# Altium project SoundBoi.PrjPcb
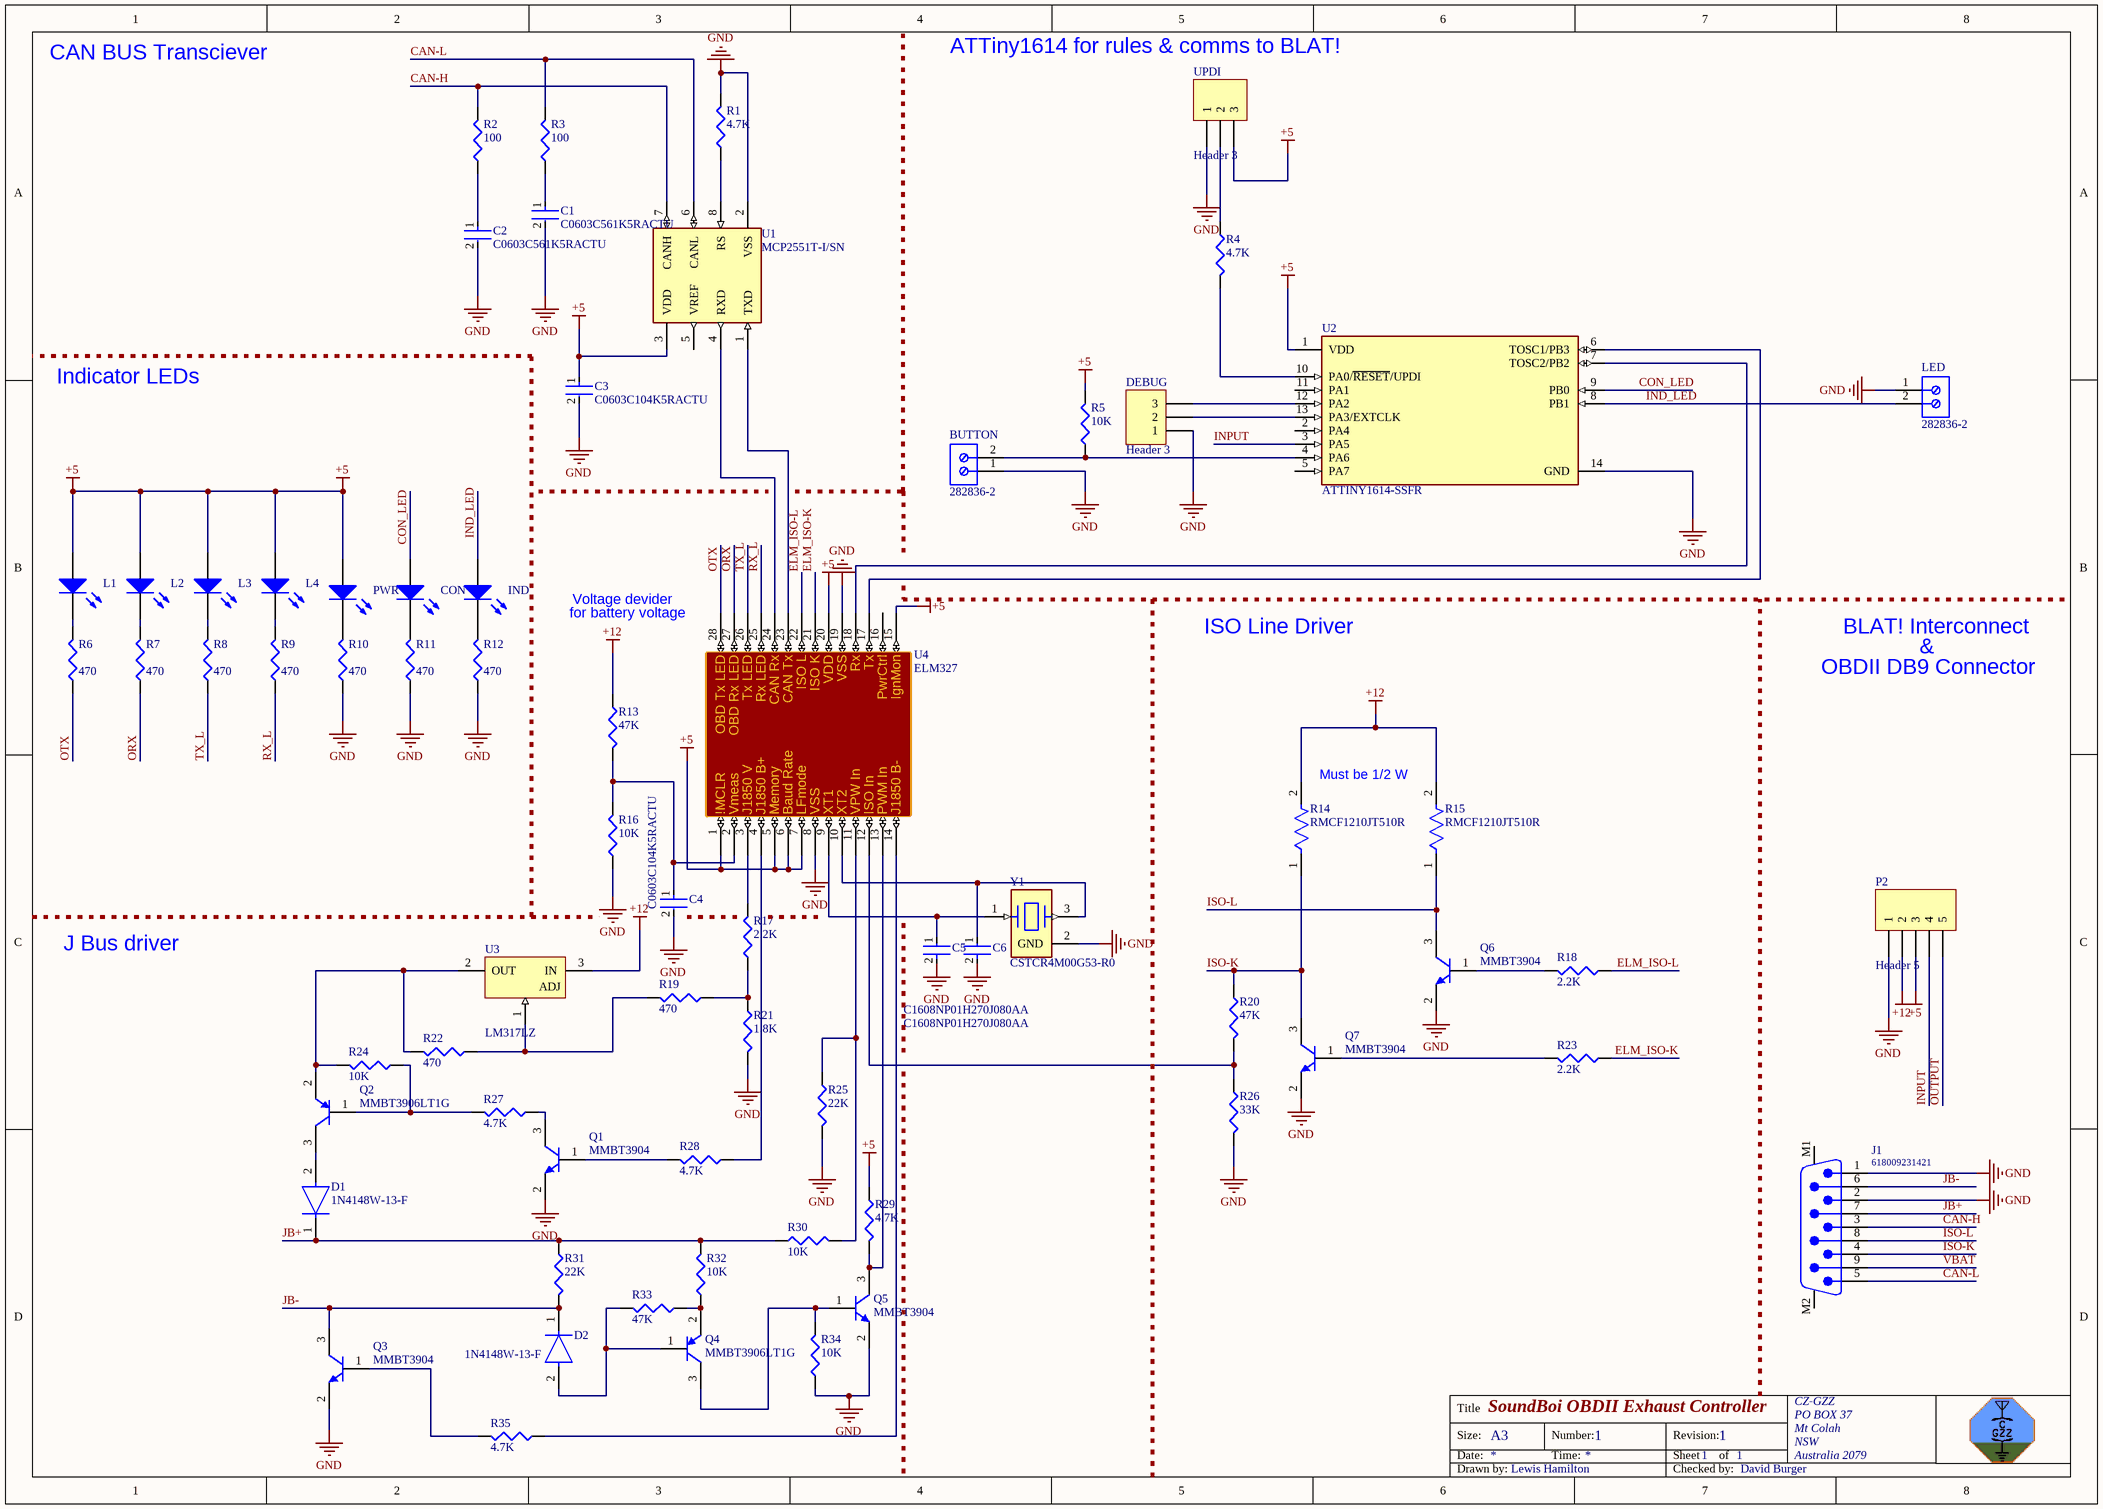
[diagram p0: Main.SchDoc]
1 sheet, 68 parts. Net scope: global (net labels, ports and power ports of the same name join across sheets).
Board file: PCB.PcbDoc

## Sheet Main.SchDoc: SoundBoi OBDII Exhaust Controller
size A3; CheckedBy: David Burger; Author: Lewis Hamilton; CompanyName: CZGZZ; DrawnBy: Lewis Hamilton; Engineer: Lewis Hamilton; Organization: CZ-GZZ; Address1: PO BOX 37; Address2: Mt Colah; Address3: NSW; Address4: Australia 2079; DocumentNumber: 1; Revision: 1; SheetNumber: 1; SheetTotal: 1

### Parts
BUTTON  282836-2  [TECO-282836-2_V]
C1  C0603C561K5RACTU  [FP-C0603C-CF-MFG]
C2  C0603C561K5RACTU  [FP-C0603C-CF-MFG]
C3  C0603C104K5RACTU  [FP-C0603C-CF-MFG]
C4  C0603C104K5RACTU  [FP-C0603C-CF-MFG]
C5  C1608NP01H270J080AA  [FP-C1608-080-0_1-IPC_A]
C6  C1608NP01H270J080AA  [FP-C1608-080-0_1-IPC_A]
CON  LED2  [3.2X1.6X1.1]  (value not drawn)
D1  1N4148W-13-F  [FP-SOD123-MFG]
D2  1N4148W-13-F  [FP-SOD123-MFG]
DEBUG  Header 3  [HDR1X3]
IND  LED2  [3.2X1.6X1.1]  (value not drawn)
J1  618009231421  [618009231421]
L1  LED2  [3.2X1.6X1.1]  (value not drawn)
L2  LED2  [3.2X1.6X1.1]  (value not drawn)
L3  LED2  [3.2X1.6X1.1]  (value not drawn)
L4  LED2  [3.2X1.6X1.1]  (value not drawn)
LED  282836-2  [TECO-282836-2_V]
P2  Header 5  [HDR1X5]
PWR  LED2  [3.2X1.6X1.1]  (value not drawn)
Q1  MMBT3904  [FAIR-SOT23-3_V]
Q2  MMBT3906LT1G  [ONSC-SOT-23-3-318-08_V]
Q3  MMBT3904  [FAIR-SOT23-3_V]
Q4  MMBT3906LT1G  [ONSC-SOT-23-3-318-08_V]
Q5  MMBT3904  [FAIR-SOT23-3_V]
Q6  MMBT3904  [FAIR-SOT23-3_V]
Q7  MMBT3904  [FAIR-SOT23-3_V]
R1  value 4.7K  [J1-0603]  (hidden comment: Res3)
R2  value 100  [J1-0603]  (hidden comment: Res3)
R3  value 100  [J1-0603]  (hidden comment: Res3)
R4  value 4.7K  [J1-0603]  (hidden comment: Res3)
R5  value 10K  [J1-0603]  (hidden comment: Res3)
R6  value 470  [J1-0603]  (hidden comment: Res3)
R7  value 470  [J1-0603]  (hidden comment: Res3)
R8  value 470  [J1-0603]  (hidden comment: Res3)
R9  value 470  [J1-0603]  (hidden comment: Res3)
R10  value 470  [J1-0603]  (hidden comment: Res3)
R11  value 470  [J1-0603]  (hidden comment: Res3)
R12  value 470  [J1-0603]  (hidden comment: Res3)
R13  value 47K  [J1-0603]  (hidden comment: Res3)
R14  RMCF1210JT510R  [FP-RMCF1210-MFG]
R15  RMCF1210JT510R  [FP-RMCF1210-MFG]
R16  value 10K  [J1-0603]  (hidden comment: Res3)
R17  value 2.2K  [J1-0603]  (hidden comment: Res3)
R18  value 2.2K  [J1-0603]  (hidden comment: Res3)
R19  value 470  [J1-0603]  (hidden comment: Res3)
R20  value 47K  [J1-0603]  (hidden comment: Res3)
R21  value 1.8K  [J1-0603]  (hidden comment: Res3)
R22  value 470  [J1-0603]  (hidden comment: Res3)
R23  value 2.2K  [J1-0603]  (hidden comment: Res3)
R24  value 10K  [J1-0603]  (hidden comment: Res3)
R25  value 22K  [J1-0603]  (hidden comment: Res3)
R26  value 33K  [J1-0603]  (hidden comment: Res3)
R27  value 4.7K  [J1-0603]  (hidden comment: Res3)
R28  value 4.7K  [J1-0603]  (hidden comment: Res3)
R29  value 4.7K  [J1-0603]  (hidden comment: Res3)
R30  value 10K  [J1-0603]  (hidden comment: Res3)
R31  value 22K  [J1-0603]  (hidden comment: Res3)
R32  value 10K  [J1-0603]  (hidden comment: Res3)
R33  value 47K  [J1-0603]  (hidden comment: Res3)
R34  value 10K  [J1-0603]  (hidden comment: Res3)
R35  value 4.7K  [J1-0603]  (hidden comment: Res3)
U1  MCP2551T-I/SN  [FP-C04-057-SN-IPC_B]
U2  ATTINY1614-SSFR  [FP-C04-065-D3X-MFG]
U3  LM317LZ  [Z03A]
U4  ELM327  [SOIC28]
UPDI  Header 3  [HDR1X3]
Y1  CSTCR4M00G53-R0  [FP-CSTCR4M00G53-R0-MFG]

### Nets
+5: C3.1 L1.1(A) L2.1(A) L3.1(A) L4.1(A) P2.3 PWR.1(A) R5.2 R29.1 U1.3(VDD) U2.1(VDD) U4.1 U4.5 U4.6 U4.7 U4.15 U4.20 UPDI.3
+12: P2.2 R13.1 R14.2 R15.2 U3.3(IN)
GND: BUTTON.1 C1.2 C2.2 C3.2 C4.2 C5.2 C6.2 DEBUG.1 J1.1 J1.2 LED.1 P2.1 Q1.2(E) Q3.2(E) Q5.2(E) Q6.2(E) Q7.2(E) R1.2 R10.1 R11.1 R12.1 R16.1 R21.2 R25.2 R26.2 R34.1 U1.2(VSS) U2.14(GND) U4.8 U4.19 UPDI.1 Y1.2(GND)
CAN-H: J1.3 R2.2 U1.7(CANH)
CAN-L: J1.5 R3.2 U1.6(CANL)
CON_LED: CON.1(A) U2.9(PB0)
ELM_ISO-K: R23.1 U4.21
ELM_ISO-L: R18.1 U4.22
IND_LED: IND.1(A) LED.2 U2.8(PB1)
INPUT: P2.4 U2.3(PA5)
ISO-K: J1.4 Q7.3(C) R14.1 R20.1
ISO-L: J1.8 Q6.3(C) R15.1
JB+: D1.1(C) J1.7 R30.1 R31.1 R32.2
JB-: D2.1(C) J1.6 Q3.3(C) R31.2
ORX: R7.1 U4.27
OTX: R6.1 U4.28
OUTPUT: P2.5
RX_L: R9.1 U4.25
TX_L: R8.1 U4.26
VBAT: J1.9
NetBUTTON_2: BUTTON.2 R5.1 U2.4(PA6)
NetC1_1: C1.1 R3.1
NetC2_1: C2.1 R2.1
NetC4_1: C4.1 R13.2 R16.2 U4.2
NetC5_1: C5.1 U4.9 Y1.1(Input)
NetC6_1: C6.1 U4.10 Y1.3(Output)
NetCON_2: CON.2(K) R11.2
NetD1_2: D1.2(A) Q2.3(C)
NetD2_2: D2.2(A) Q4.1(B) R33.2
NetDEBUG_2: DEBUG.2 U2.13(PA3/EXTCLK)
NetDEBUG_3: DEBUG.3 U2.12(PA2)
NetIND_2: IND.2(K) R12.2
NetL1_2: L1.2(K) R6.2
NetL2_2: L2.2(K) R7.2
NetL3_2: L3.2(K) R8.2
NetL4_2: L4.2(K) R9.2
NetPWR_2: PWR.2(K) R10.2
NetQ1_1: Q1.1(B) R28.2
NetQ1_3: Q1.3(C) R27.1
NetQ2_1: Q2.1(B) R24.1 R27.2
NetQ2_2: Q2.2(E) R22.2 R24.2 U3.2(OUT)
NetQ3_1: Q3.1(B) R35.2
NetQ4_2: Q4.2(E) R32.1 R33.1
NetQ4_3: Q4.3(C) Q5.1(B) R34.2
NetQ5_3: Q5.3(C) R29.2 U4.13
NetQ6_1: Q6.1(B) R18.2
NetQ7_1: Q7.1(B) R23.2
NetR1_1: R1.1 U1.8(RS)
NetR4_1: R4.1 UPDI.2
NetR4_2: R4.2 U2.10(PA0/~{RESET}/UPDI)
NetR17_1: R17.1 R19.1 R21.1
NetR17_2: R17.2 U4.3
NetR19_2: R19.2 R22.1 U3.1(ADJ)
NetR20_2: R20.2 R26.1 U4.12
NetR25_1: R25.1 R30.2 U4.11
NetR28_1: R28.1 U4.4
NetR35_1: R35.1 U4.14
NetU1_1: U1.1(TXD) U4.23
NetU1_4: U1.4(RXD) U4.24
NetU2_6: U2.6(TOSC1/PB3) U4.17
NetU2_7: U2.7(TOSC2/PB2) U4.18

Not connected (* = marked no-connect by the designer): J1 M1 M2; U1 5(VREF); U2 2(PA4) 5(PA7) 11(PA1); U4 16

### Notes on the sheet
- CAN BUS Transciever
- ATTiny1614 for rules & comms to BLAT!
- Indicator LEDs
- Voltage devider
- for battery voltage
- ISO Line Driver
- &
- BLAT! Interconnect
- OBDII DB9 Connector
- Must be 1/2 W
- J Bus driver
- Title
- Size:
- Date:
- A3
- Number:
- Time:
- Revision:
- Sheet
- of
- Drawn by:
- Checked by:
- (in symbol ELM327) OBD Tx LED; OBD Rx LED; Tx LED; Rx LED; CAN Rx; CAN Tx; ISO L; ISO K; VDD; VSS; Rx; Tx; PwrCtrl; IgnMon; !MCLR; Vmeas; J1850 V; J1850 B+; Memory; Baud Rate; LFmode; XT1; XT2; VPW In; ISO In; PWM In; J1850 B-

### Library data of the parts
BUTTON LED = CMP-1684-00017-1: Female Header, Pitch 5 mm, 1 x 2 Position, Height 10 mm, Tail Length 3.5 mm, Rohs, Bulk; Manufacturer: TE Connectivity; Wire Gauge: 16-30AWG; Product Training Modules: Wire-to-BoardEurostyleTerminalBlocks; Clamp Material - Plating: Brass-NickelPlated; Voltage: 300V; Mating Orientation: HorizontalwithBoard; Current: 13.5A; Pitch: 0.197"(5.00mm); Screw Thread: M3; 3D Model: 282836-2.pdf; Other Names: 5ULV-02B / A98076; Dynamic Catalog: BuchananSeries; Number of Levels: 1; Torque - Screw: 0.68Nm(6Lb-In); Featured Product: EurostyleTerminalBlockConnectors; Positions Per Level: 2; Wire Termination: Screw-RisingCageClamp; Datasheet URL: http://www.te.com.cn/commerce/DocumentDelivery/DDEController?Action=showdoc&DocId=Catalog+Section%7F1308389_EUROSTYLE_TERMINAL_BLOCKS%7F0607%7Fpdf%7FEnglish%7FENG_CS_1308389_EUROSTYLE_TERMINAL_BLOCKS_0607.pdf%7F282836-2; Color: Green; Family: TerminalBlocks-WiretoBoard; RoHS Information: 282836-2StatementofCompliance; Standard Package: 300; Contact Material - Plating: Brass-TinPlated; Manufacturer URL: http://www.te.com; Housing Material: Polyamide(PA66),Nylon6/6; Features: Interlocking(Side); Package Description: Female Header, Pitch 5 mm, 1 x 2 Position, Height 10 mm, Tail Length 3.5 mm; Mounting Type: ThroughHole; Package Reference: THD; Packaging: Bulk; Series: Buchanan; Category: Connectors,Interconnects; Screw Material - Plating: Brass-NickelPlated
C1 C2 = CMP-2006-03245-2: CAP CER 560PF 50V X7R 0603; Manufacturer: KEMET; Tolerance: 0.1; Material: Ceramic; Automotive Grade: Grade 1; Temperature Coefficient: 30ppm/°C; Temperature Range High: +125°C; Category: Cap; Voltage Rating: 50 V; Lead Free: Yes; RoHS: TRUE; Octopart: https://octopart.com/c0603c561k5ractu-kemet-138569; Device Class L3: Ceramic Capacitors; Temperature: -55°C to +125°C; Automotive: Yes; Manufacturer Part Number: C0603C561K5RACTU; Device Class L1: Passive Components; Mouser Description: C0603C 560pF Ceramic Multilayer Capacitor, 50 VDC, +125degC, X7R Dielec, +/-10%; Capacitance: 560 pF; Temperature Characteristic: X7R; ComponentLink2URL: https://api.kemet.com/component-edge/download/datasheet/C0603C100J5GACAUTO.pdf; Temperature Range Low: -55°C; Digikey Description: CAP CER 560PF 50V X7R 0603; Device Class L2: Capacitors; ComponentLink2Description: Datasheet; Package: C0603C-CF; Value: 560 pF; Height: 0.87mm
C3 C4 = CMP-2006-03061-2: CAP CER 0.1UF 50V X7R 0603; Manufacturer: KEMET; Tolerance: 0.1; Temperature Coefficient: 30ppm/°C; Material: Ceramic; Automotive Grade: Grade 1; Value: 0.10 μF; Temperature: -55°C to +125°C; RoHS: TRUE; Temperature Range High: +125°C; Lead Free: Yes; Octopart: https://octopart.com/c0603c104k5ractu-kemet-139244; Digikey Description: CAP CER 0.1UF 50V X7R 0603; Category: Cap; Package: C0603C-CF; ComponentLink2Description: Datasheet; Temperature Range Low: -55°C; Device Class L1: Passive Components; Voltage Rating: 50 V; Automotive: Yes; Device Class L3: Ceramic Capacitors; ComponentLink2URL: https://api.kemet.com/component-edge/download/datasheet/C0603C100J5GACAUTO.pdf; Capacitance: 0.10 μF; Device Class L2: Capacitors; Manufacturer Part Number: C0603C104K5RACTU; Temperature Characteristic: X7R; Height: 0.87mm
C5 C6 = CMP-08246-003773-1: Multilayer Ceramic Capacitors 27pF ±5% 50V NP0 SMD 0603; Dielectric: C0G; Voltage Rating: 50V; Features: High Temperature; Height: 0.8mm; Series: C; Tolerance: 5%; Min Operating Temperature: -55°C; RoHS Compliant: Yes; Mount: Surface Mount; Thickness: 0.035inch; Length: 0.063inch; Voltage Rating (DC): 50V; Termination: SMD/SMT; Case/Package: 0603; Package Quantity: 4000; Packaging: Tape and Reel; Case Code (Imperial): 0603; Weight: 7.1E-05oz; Width: 0.8mm; Max Operating Temperature: 150°C; Case Code (Metric): 1608; Capacitance: 27pF
CON IND L1-L4 PWR = LED2: Typical RED, GREEN, YELLOW, AMBER GaAs LED; Published: 8-Jun-2000; LatestRevisionDate: 17-Jul-2002; LatestRevisionNote: Re-released for DXP Platform.; PackageVersion: Feb-2002; PackageReference: 3.2X1.6X1.1; Publisher: Altium Limited; PackageDescription: SM LED; 2 Flat Leads
D1 D2 = CMP-12791-000005-1: DIODE GEN PURP 100V 150MA SOD123; Manufacturer: Diodes Inc.; Capacitance: 2pF; Forward Current: 300mA; Max Junction Temp: +150°C; Value: 2pF; Standoff Height: 0mm; Peak Reverse Current: 1uA; Max Surge Forward Current: 1A; Category: Diode; Height: 1.45mm; ComponentLink2URL: https://upverter.com/datasheet/628e7d6fee5901eee6eef4567d1c3569f2cd3cde.pdf; Lead Free: Yes; ComponentLink2Description: Datasheet; Octopart: https://octopart.com/1n4148w-13-f-diodes+inc.-2359612; Temperature Range High: +150°C; Device Class L2: Diodes; Digikey Description: DIODE GEN PURP 100V 150MA SOD123; Reverse Voltage: 100V; Temperature Range Low: -65°C; Device Class L1: Discrete Semiconductors; Package: SOD123; RoHS: TRUE; Manufacturer Part Number: 1N4148W-13-F; Footprint Url: https://www.diodes.com/assets/Package-Files/SOD123.pdf; Automotive: No; Max Repetitive Reverse Voltage: 100V; Mouser Description: 1N4148W Series 2 A 100 V 400 mW Surface Mount Fast Switching Diode - SOD-123; Temperature: -65°C to +150°C; Device Class L3: Rectifier Diodes
DEBUG UPDI = Header 3: Header, 3-Pin; LatestRevisionDate: 17-Jul-2002; LatestRevisionNote: Re-released for DXP Platform.; Publisher: Altium Limited
J1 = CMP-1502-00288-1: Male PCB Connector with Hex Screw WR-DSUB, 10.30 mm, Angled, 9 pins; Manufacturer: Wurth Elektronik; Pin Number: 9; Rated Current: 3A; Working Voltage: 125VAC; Contact Resistance: 30mOhm; Publisher: WurthElektronik; Datasheet URL: https://katalog.we-online.de/em/datasheet/6180xx231421.pdf; Operating Temperature: -40to85degC; Part Number: 618009231421; Mounting Technology: THT; Package Reference: 618009231421; Manufacturer URL: http://www.we-online.de; Gender: Male; Orientation: Angled; Packaging: Tray
P2 = Header 5: Header, 5-Pin; LatestRevisionDate: 17-Jul-2002; LatestRevisionNote: Re-released for DXP Platform.; Publisher: Altium Limited
Q1 Q3 Q5-Q7 = CMP-1670-00008-1: NPN General Purpose Amplifier, 40 V, 0.2 A, -55 to 150 degC, 3-Pin SOT23, RoHS, Tape and Reel; Tolerance: 30ppm; Capacitance: 1.8E-11 f; Frequency: 12.288 MHz; ESR: 40 Ohm; Load Capacitance: 18 pF; REACH SVHC: No SVHC; Pins: 4; ComponentLink3URL: http://www.fairchildsemi.com/dwg/MA/MA03D.pdf; PackageDescription: 3-Pin Small Outline Transistor, Body 2.92 x 1.325 mm, Pitch 0.95 mm; ComponentLink1URL: https://www.fairchildsemi.com/; Max Operating Temperature: 70degC; PackageReference: SOT23-3; ComponentLink1Description: Manufacturer URL; Width: 0.126 inch; Min Operating Temperature: -20degC; DatasheetVersion: Rev. 1.1.0, 10/2014; Mount: Surface Mount; Height: 0.041 inch; Package Quantity: 1000; Frequency Tolerance: 30ppm; Packaging: Tape and Reel; ComponentLink2URL: https://www.fairchildsemi.com/datasheets/MM/MMBT3904.pdf; RoHSCompliant: True; ComponentLink3Description: Package Specification; ComponentLink2Description: Datasheet; Length: 0.197 inch
Q2 Q4 = CMP-1048-00670-1: General Purpose Transistor, PNP Silicon, 3-Pin SOT-23, Pb-Free, Tape and Reel; Manufacturer: On Semiconductor; IC Continuous (A): -0.2; fT Min (MHz): 250; PackageDescription: 3-Pin Small Outline Transistor, Body 2.92 x 1.3 mm, Pitch 0.95 mm; PartNumber: MMBT3906LT1G; Packing: Tape and Reel; ComponentLink3Description: Package Specification; Mounting Technology: Surface Mount; ComponentLink3URL: http://www.onsemi.cn/pub_link/Collateral/318-08.PDF; ComponentLink1URL: http://www.onsemi.com/; ComponentLink2URL: http://www.onsemi.cn/pub_link/Collateral/MMBT3906LT1-D.PDF; PackageReference: SOT-23-3-318-08; Polarity: PNP; ComponentLink2Description: Datasheet; PackageVersion: Rev. AP, 11/2009; RoHS: TRUE; DatasheetVersion: Rev. 11; ComponentLink1Description: Manufacturer URL
R1-R13 R16-R35 = Res3: Resistor; Published: 8-Jun-2000; LatestRevisionDate: 29-May-2009; LatestRevisionNote: IPC-7351 Footprint Added.; PackageReference: J1-0603; Publisher: Altium Limited; PackageDescription: Chip Resistor
R14 R15 = CMP-26527-002135-1: 510Ω ±5% 0.5W 1210 Thick Film Chip Resistor AEC-Q200 compliant; Max Power Dissipation: 500mW; Resistance: 510R; Temperature Coefficient: 200ppm/°C; Lead Free: Lead Free; Width: 0.098inch; Mount: Surface Mount; Case Code (Imperial): 1210; Number of Terminations: 2; Resistor Type: Thick Film; Series: RMCF; Features: Automotive AEC-Q200; Contact Plating: Tin; Radiation Hardening: No; Length: 0.126inch; RoHS Compliant: Yes; Tolerance: 5%; Case Code (Metric): 3225; Min Operating Temperature: -55°C; Height: 0.028inch; Case/Package: 1210; Packaging: Tape and Reel; Max Operating Temperature: 155°C; Package Quantity: 4000
U1 = CMP-0186-00037-3: IC TRANSCEIVER HALF 1/1 8SOIC; Interface: CAN; Nominal Supply Current: 75mA; Number of Receive Buffers: 1; Operating Supply Voltage: 5V; Data Rate: 1Mbps; Max Supply Voltage: 5.5V; Min Supply Voltage: 4.5V; Package Quantity: 3300; Packaging: Tape and Reel; REACH SVHC: No SVHC; Radiation Hardening: No; Case/Package: SOIC; Max Supply Current: 75mA; Lead Free: Lead Free; Number of Transmit Buffers: 1; Length: 4.9mm; Number of Transceivers: 1; Min Operating Temperature: -40°C; Number of Pins: 8; Height: 1.5mm; Max Operating Temperature: 85°C; Number of Receivers: 1; Logic Function: Transceiver; Width: 3.9mm; Mount: Surface Mount; Number of Drivers: 1
U2 = CMP-06276-000021-1: IC MCU 8BIT 16KB FLASH 14SOIC; Manufacturer: Microchip; Number Of A/D Converters: 2; Number Of Uart Channels: 1; Min Supply Voltage: 1.8V; Interface: I2C,SPI,UART,USART,2-Wire,LIN,IrDA; Memory Size: 16KBytes; Core Architecture: AVR; Nominal Supply Current: 2.6-10200uA; Data Bus Width: 8bits; Max Supply Voltage: 5.5V; Number Of I/Os: 12; Standoff Height: 0.1mm; Number Of Adc Channels: 14; Ram Size: 2KBytes; Number Of Timers/Counters: 5; Frequency: 16MHz; Temperature Range High: +125°C; Device Class L3: Microcontrollers; Number Of Cores: 1; Temperature Range Low: -40°C; Ipc Land Pattern Name: SOIC127P600X175-14; Height: 1.75mm; Category: IC; Number Of Pwm Channels: 1; Manufacturer Part Number: ATTINY1614-SSFR; Device Class L2: Embedded Processors and Controllers; ComponentLink2Description: Datasheet; Device Class L1: Integrated Circuits (ICs); Number Of Spi Channels: 1; Lead Free: Yes; Digikey Description: IC MCU 8BIT 16KB FLASH 14SOIC; Number Of I2C Channels: 1; Memory Type: FLASH; ComponentLink2URL: http://ww1.microchip.com/downloads/en/DeviceDoc/ATtiny1614-DataSheet-DS40001995B.pdf; RoHS: TRUE; Package: C04-065-D3X; Temperature: -40°C to +125°C; Mouser Description: 8-Bit AVR Microcontroller 16Kbyte Flash 2Kbyte SRAM 14-Pin SOIC T/R; Automotive: No; Octopart: https://octopart.com/attiny1614-ssfr-microchip-82181131
U3 = CMP-0062-00072-2: 3-Terminal Adjustable Regulator, 3-pin TO-92; Manufacturer: National Semiconductor; CompType: LDO IC; PackageTopMarking: NSXYTT*LM317*LZ; PowerWise: N; ComponentLink1URL: http://www.national.com/ds/LM/LM317L.pdf; PackageReference: Z03A; ComponentLink3URL: http://www.national.com/packaging/folders/z03a.html; ComponentLink2Description: LM317L Web Page; ComponentLink3Description: Z03A Package Page; RoHS: N; DatasheetVersion: Apr-2008; PinCount: 3; PackageVersion: revG, Sep-2000; ComponentLink2URL: http://www.national.com/pf/LM/LM317L.html; RevisionNote: Component URLs added; PackageDescription: TO-92, Molded, 3 Lead; ComponentLink1Description: LM317L Datasheet; Code_JEDEC: TO-226-AA
Y1 = CMP-06057-000010-1: CERAMIC RES 4.0000MHZ 15PF SMD; Frequency: 4MHz; Impedance: 60R; Frequency Tolerance: 0.5%; Frequency Stability: 0.2%; Voltage Rating (DC): 6V; Width: 2mm; Height: 0.047inch; Self Resonant Frequency: 4MHz; Case/Package: SMD/SMT; REACH SVHC: No SVHC; Package Quantity: 3000; Capacitance: 15pF; Mount: Surface Mount; Lead Free: Lead Free; Tolerance: 0.5%; Resistor Type: Ceramic; Max Operating Temperature: 80°C; Min Operating Temperature: -20°C; Number of Pins: 3; Length: 4.5mm; Termination: SMD/SMT; Dielectric Material: Ceramic; Packaging: Tape and Reel; Load Capacitance: 15pF; Contact Plating: Gold